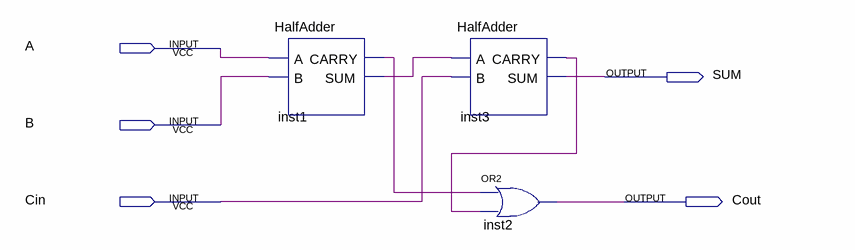
[diagram p0: schematic sheet]
// Quartus schematic FullAdder.bdf as structural Verilog: 3 symbols, 5 pins
module FullAdder (
  input  A,
  input  B,
  input  Cin,
  output SUM,
  output Cout
);

  wire inst1_carry, inst1_sum, inst3_carry;

  HalfAdder inst1 (.A(A), .B(B), .CARRY(inst1_carry), .SUM(inst1_sum));
  HalfAdder inst3 (.A(inst1_sum), .B(Cin), .CARRY(inst3_carry), .SUM(SUM));
  or inst2 (Cout, inst1_carry, inst3_carry);
endmodule
